# EAGLE design mainBoard (EAGLE 7.2.0)

## Sheet 1 of 5: CPU
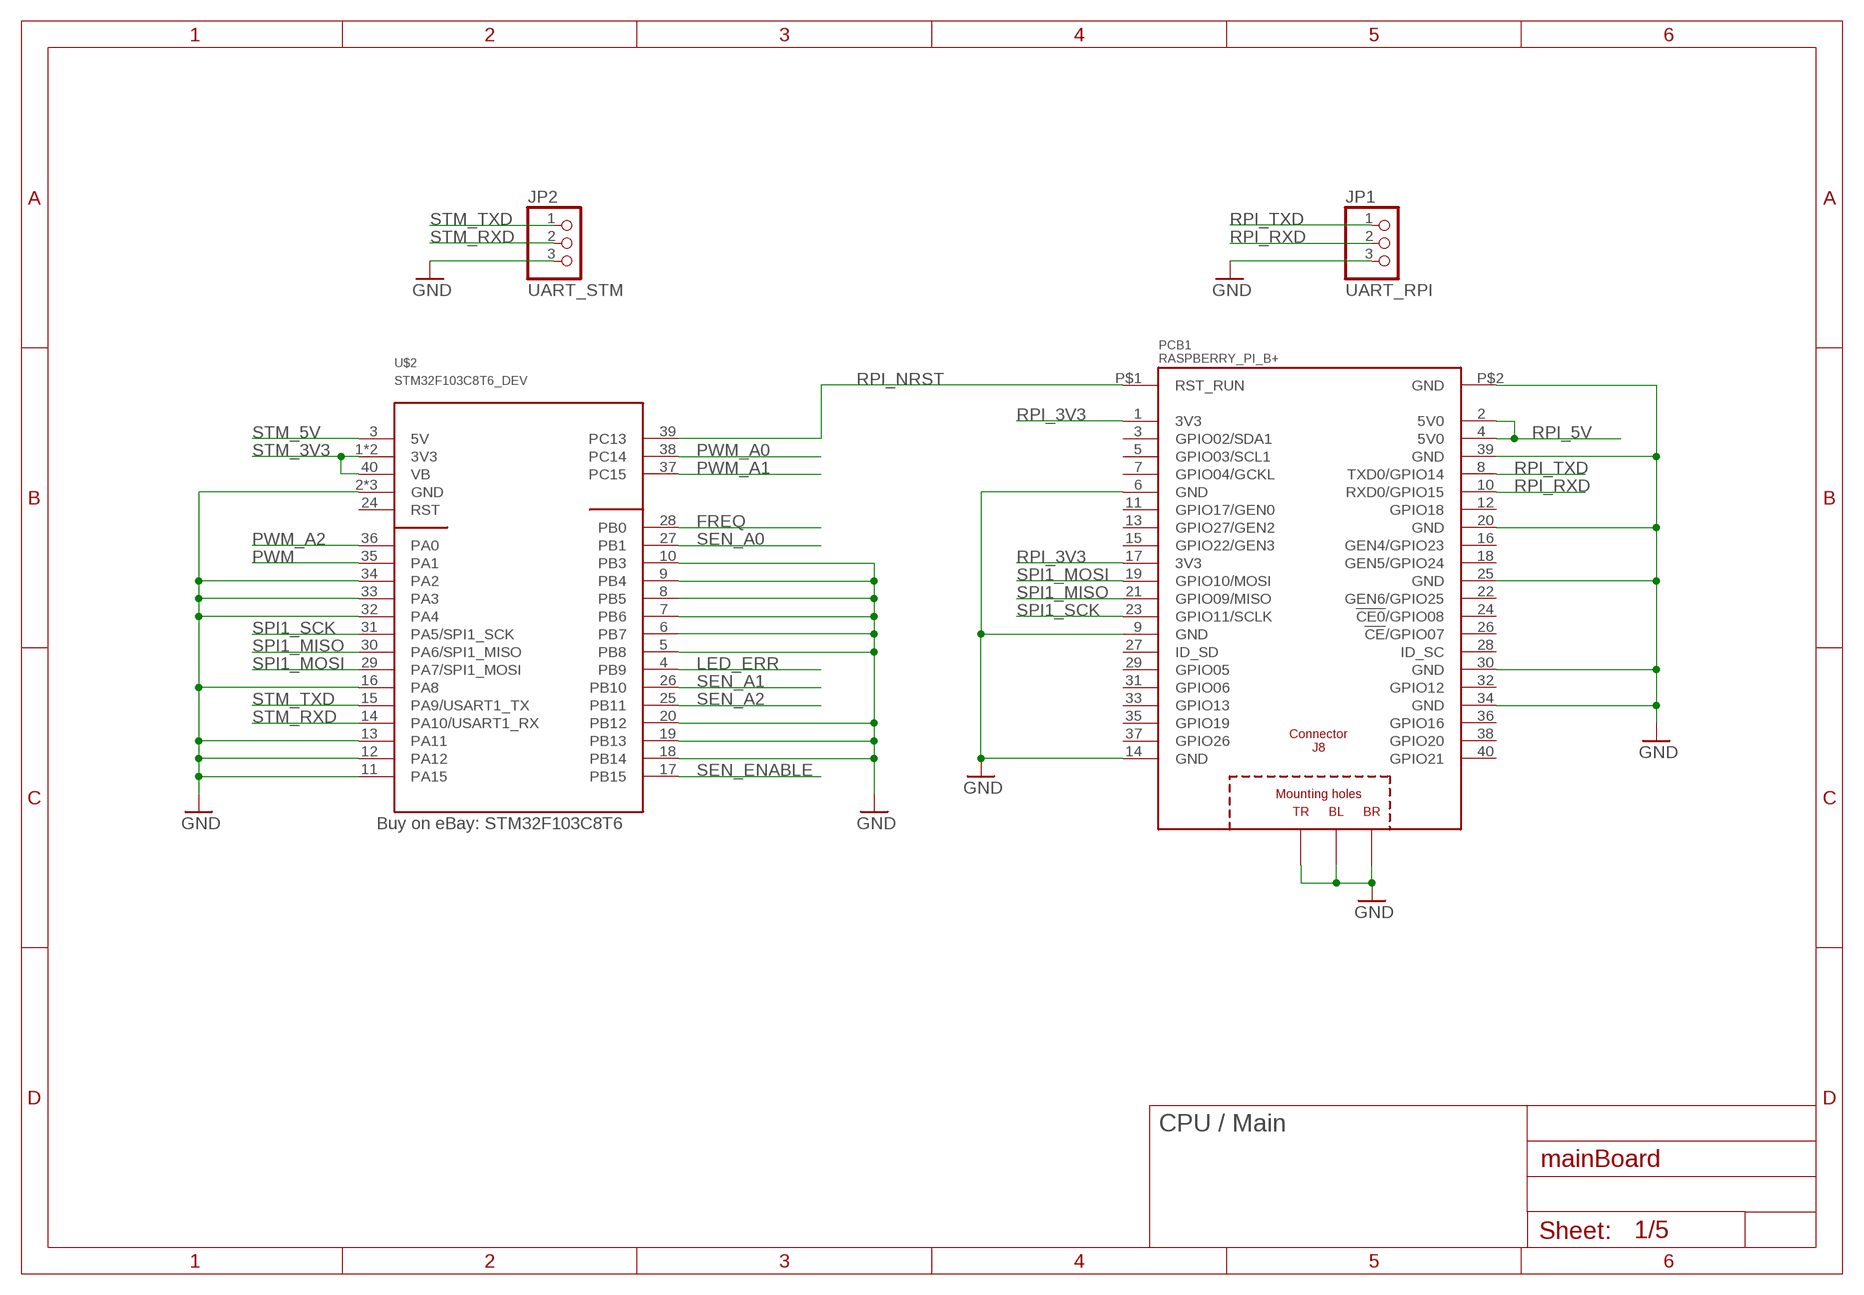
[diagram p0: schematic, sheet 1]

### Parts
JP1  UART_RPI  PINHD-1X3  [1X03]
JP2  UART_STM  PINHD-1X3  [1X03]
PCB1  RASPBERRY_PI_B+  [RASPBERRY_PI_BPLUS_TPLACE_SMD_MIRR]
U$2  STM32F103C8T6_DEV  [STM32F103C8T6_DEV_SMD]

### Nets
FREQ: U$2.28(PB0) ; also sheet 3
GND: JP1.3 JP2.3 PCB1.6(GND) PCB1.9(GND) PCB1.14(GND) PCB1.20(GND) PCB1.25(GND) PCB1.30(GND) PCB1.34(GND) PCB1.39(GND) PCB1.P$2(GND) PCB1.PE_BL(BL) PCB1.PE_BR(BR) PCB1.PE_TR(TR) U$2.2(GND) U$2.5(PB8) U$2.6(PB7) U$2.7(PB6) U$2.8(PB5) U$2.9(PB4) U$2.10(PB3) U$2.11(PA15) U$2.12(PA12) U$2.13(PA11) U$2.16(PA8) U$2.18(PB14) U$2.19(PB13) U$2.20(PB12) U$2.21(GND) U$2.22(GND) U$2.32(PA4) U$2.33(PA3) U$2.34(PA2) ; also sheet 2,3,4,5
LED_ERR: U$2.4(PB9) ; also sheet 5
PWM: U$2.35(PA1) ; also sheet 4
PWM_A0: U$2.38(PC14) ; also sheet 4
PWM_A1: U$2.37(PC15) ; also sheet 4
PWM_A2: U$2.36(PA0) ; also sheet 4
RPI_3V3: PCB1.1(3V3) PCB1.17(3V3) ; also sheet 2
RPI_5V: PCB1.2(5V0) PCB1.4(5V0) ; also sheet 2
RPI_NRST: PCB1.P$1(RST_RUN) U$2.39(PC13)
RPI_RXD: JP1.2 PCB1.10(RXD0/GPIO15)
RPI_TXD: JP1.1 PCB1.8(TXD0/GPIO14)
SEN_A0: U$2.27(PB1) ; also sheet 3
SEN_A1: U$2.26(PB10) ; also sheet 3
SEN_A2: U$2.25(PB11) ; also sheet 3
SEN_ENABLE: U$2.17(PB15) ; also sheet 3
SPI1_MISO: PCB1.21(GPIO09/MISO) U$2.30(PA6/SPI1_MISO)
SPI1_MOSI: PCB1.19(GPIO10/MOSI) U$2.29(PA7/SPI1_MOSI)
SPI1_SCK: PCB1.23(GPIO11/SCLK) U$2.31(PA5/SPI1_SCK)
STM_3V3: U$2.1(3V3) U$2.23(3V3) U$2.40(VB) ; also sheet 2
STM_5V: U$2.3(5V) ; also sheet 2
STM_RXD: JP2.2 U$2.14(PA10/USART1_RX)
STM_TXD: JP2.1 U$2.15(PA9/USART1_TX)
Unconnected: PCB1.3(GPIO02/SDA1) PCB1.5(GPIO03/SCL1) PCB1.7(GPIO04/GCKL) PCB1.11(GPIO17/GEN0) PCB1.12(GPIO18) PCB1.13(GPIO27/GEN2) PCB1.15(GPIO22/GEN3) PCB1.16(GEN4/GPIO23) PCB1.18(GEN5/GPIO24) PCB1.22(GEN6/GPIO25) PCB1.24(!CE0!/GPIO08) PCB1.26(!CE!/GPIO07) PCB1.27(ID_SD) PCB1.28(ID_SC) PCB1.29(GPIO05) PCB1.31(GPIO06) PCB1.32(GPIO12) PCB1.33(GPIO13) PCB1.35(GPIO19) PCB1.36(GPIO16) PCB1.37(GPIO26) PCB1.38(GPIO20) PCB1.40(GPIO21) U$2.24(RST)

### Notes on the sheet
- Buy on eBay: STM32F103C8T6
- CPU / Main

## Sheet 2 of 5: PowerSupply
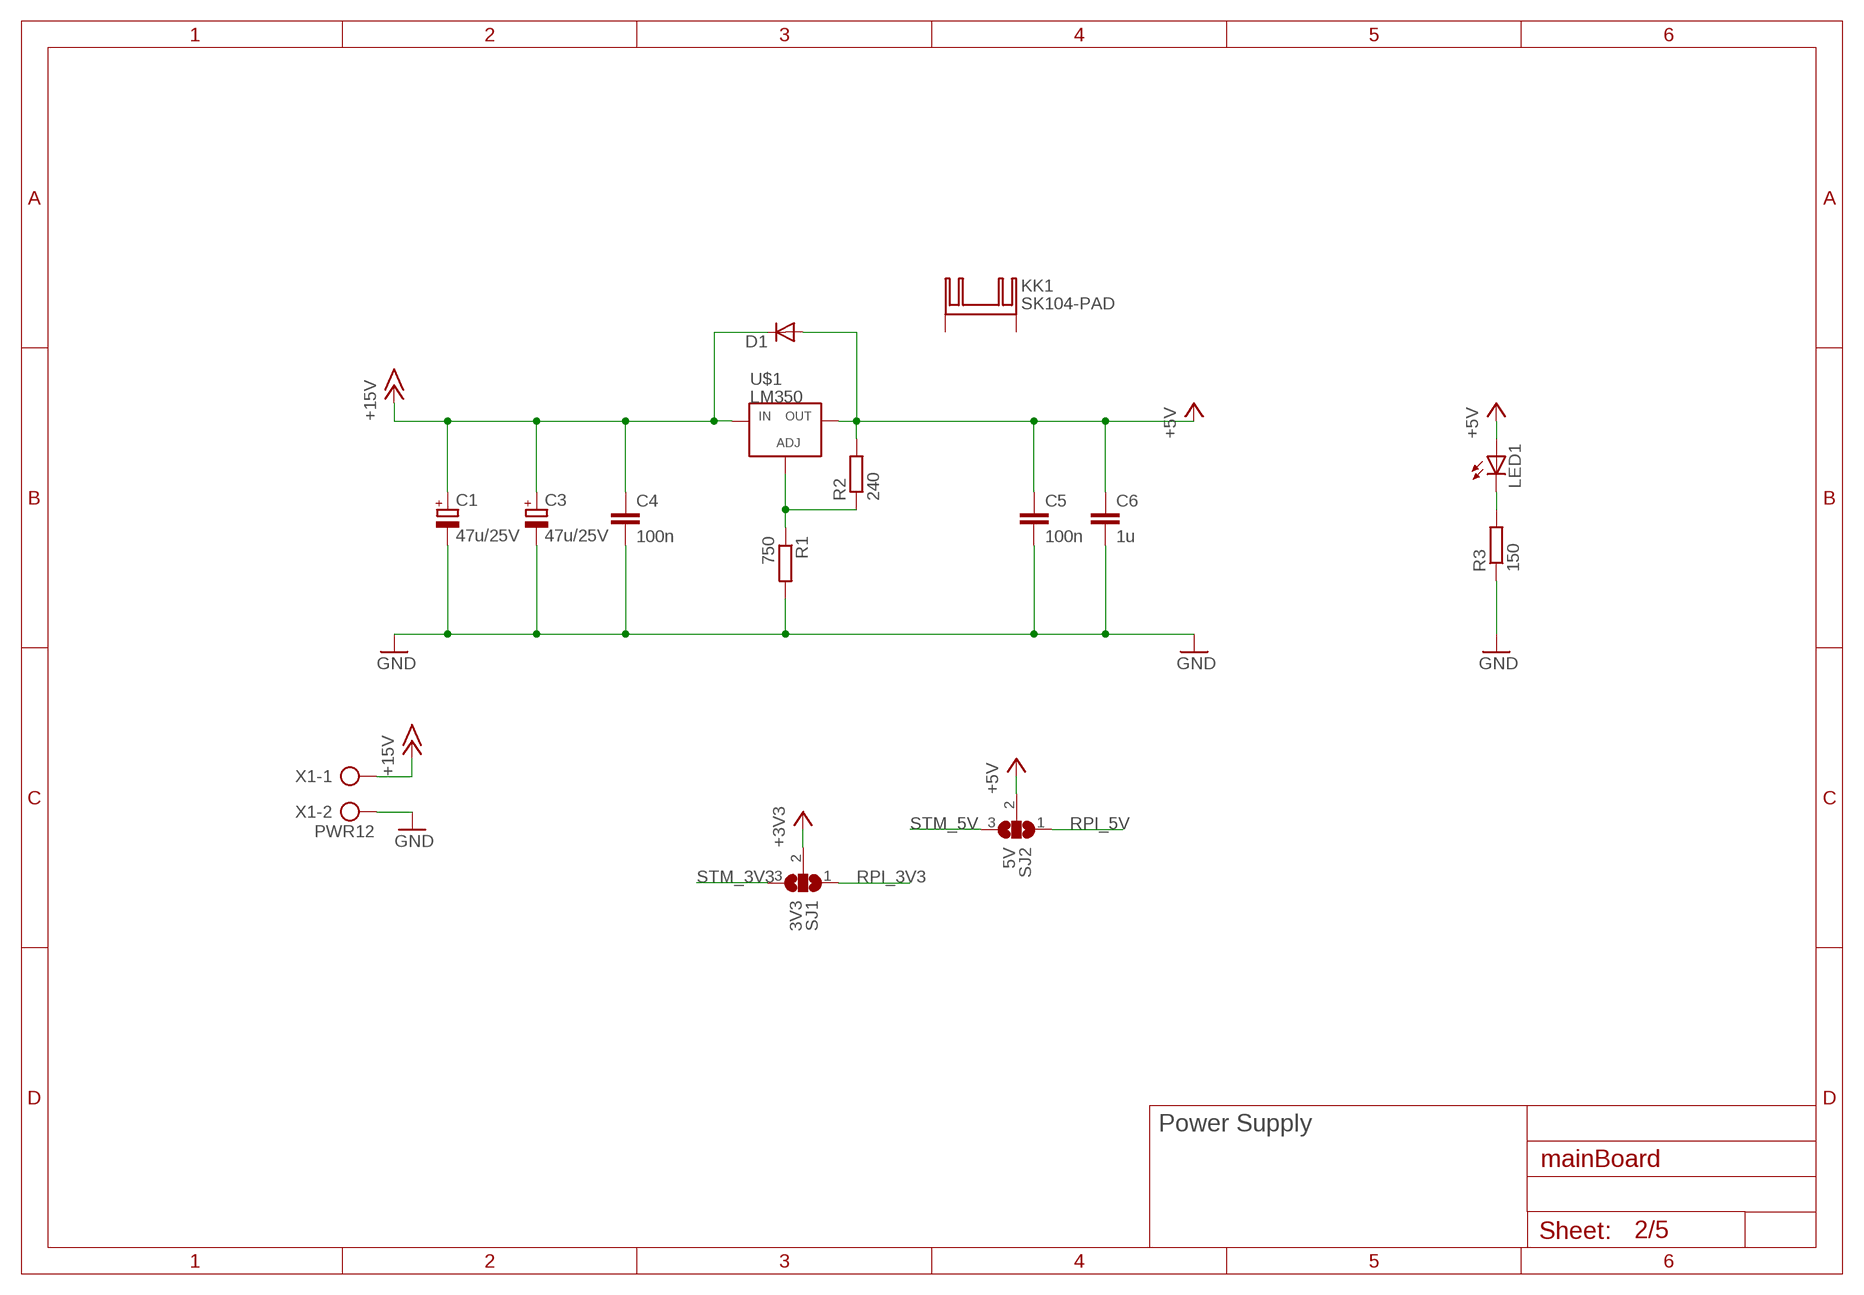
[diagram p1: schematic, sheet 2]

### Parts
C1  47u/25V  CPOL-EUD  [PANASONIC_D]
C3  47u/25V  CPOL-EUD  [PANASONIC_D]
C4  100n  C-EUC0805  [C0805]
C5  100n  C-EUC0805  [C0805]
C6  1u  C-EUC0805  [C0805]
D1  DIODE-MELF-MLL41  [MELF-MLL41]
KK1  SK104-PAD  [SK104-PAD]
LED1  LEDCHIP-LED0805  [CHIP-LED0805]
R1  750  R-EU_R0805  [R0805]
R2  240  R-EU_R0805  [R0805]
R3  150  R-EU_R0805  [R0805]
SJ1  3V3  SJ2W  [SJ_2]
SJ2  5V  SJ2W  [SJ_2]
U$1  LM350  [TO220]
X1  PWR12  AK500/2  [AK500/2]

### Nets
+3V3: SJ1.2 ; also sheet 3,4
+5V: C5.1 C6.1 D1.A LED1.A R2.2 SJ2.2 U$1.2(OUT)
+15V: C1.+ C3.+ C4.1 D1.C U$1.3(IN) X1.1 ; also sheet 4
GND: C1.- C3.- C4.2 C5.2 C6.2 R1.2 R3.1 X1.2 ; also sheet 1,3,4,5
N$9: LED1.C R3.2
N$20: R1.1 R2.1 U$1.1(ADJ)
RPI_3V3: SJ1.1 ; also sheet 1
RPI_5V: SJ2.1 ; also sheet 1
STM_3V3: SJ1.3 ; also sheet 1
STM_5V: SJ2.3 ; also sheet 1
Unconnected: KK1.K1(K) KK1.K2(K)

### Notes on the sheet
- Power Supply

## Sheet 3 of 5: Sensors
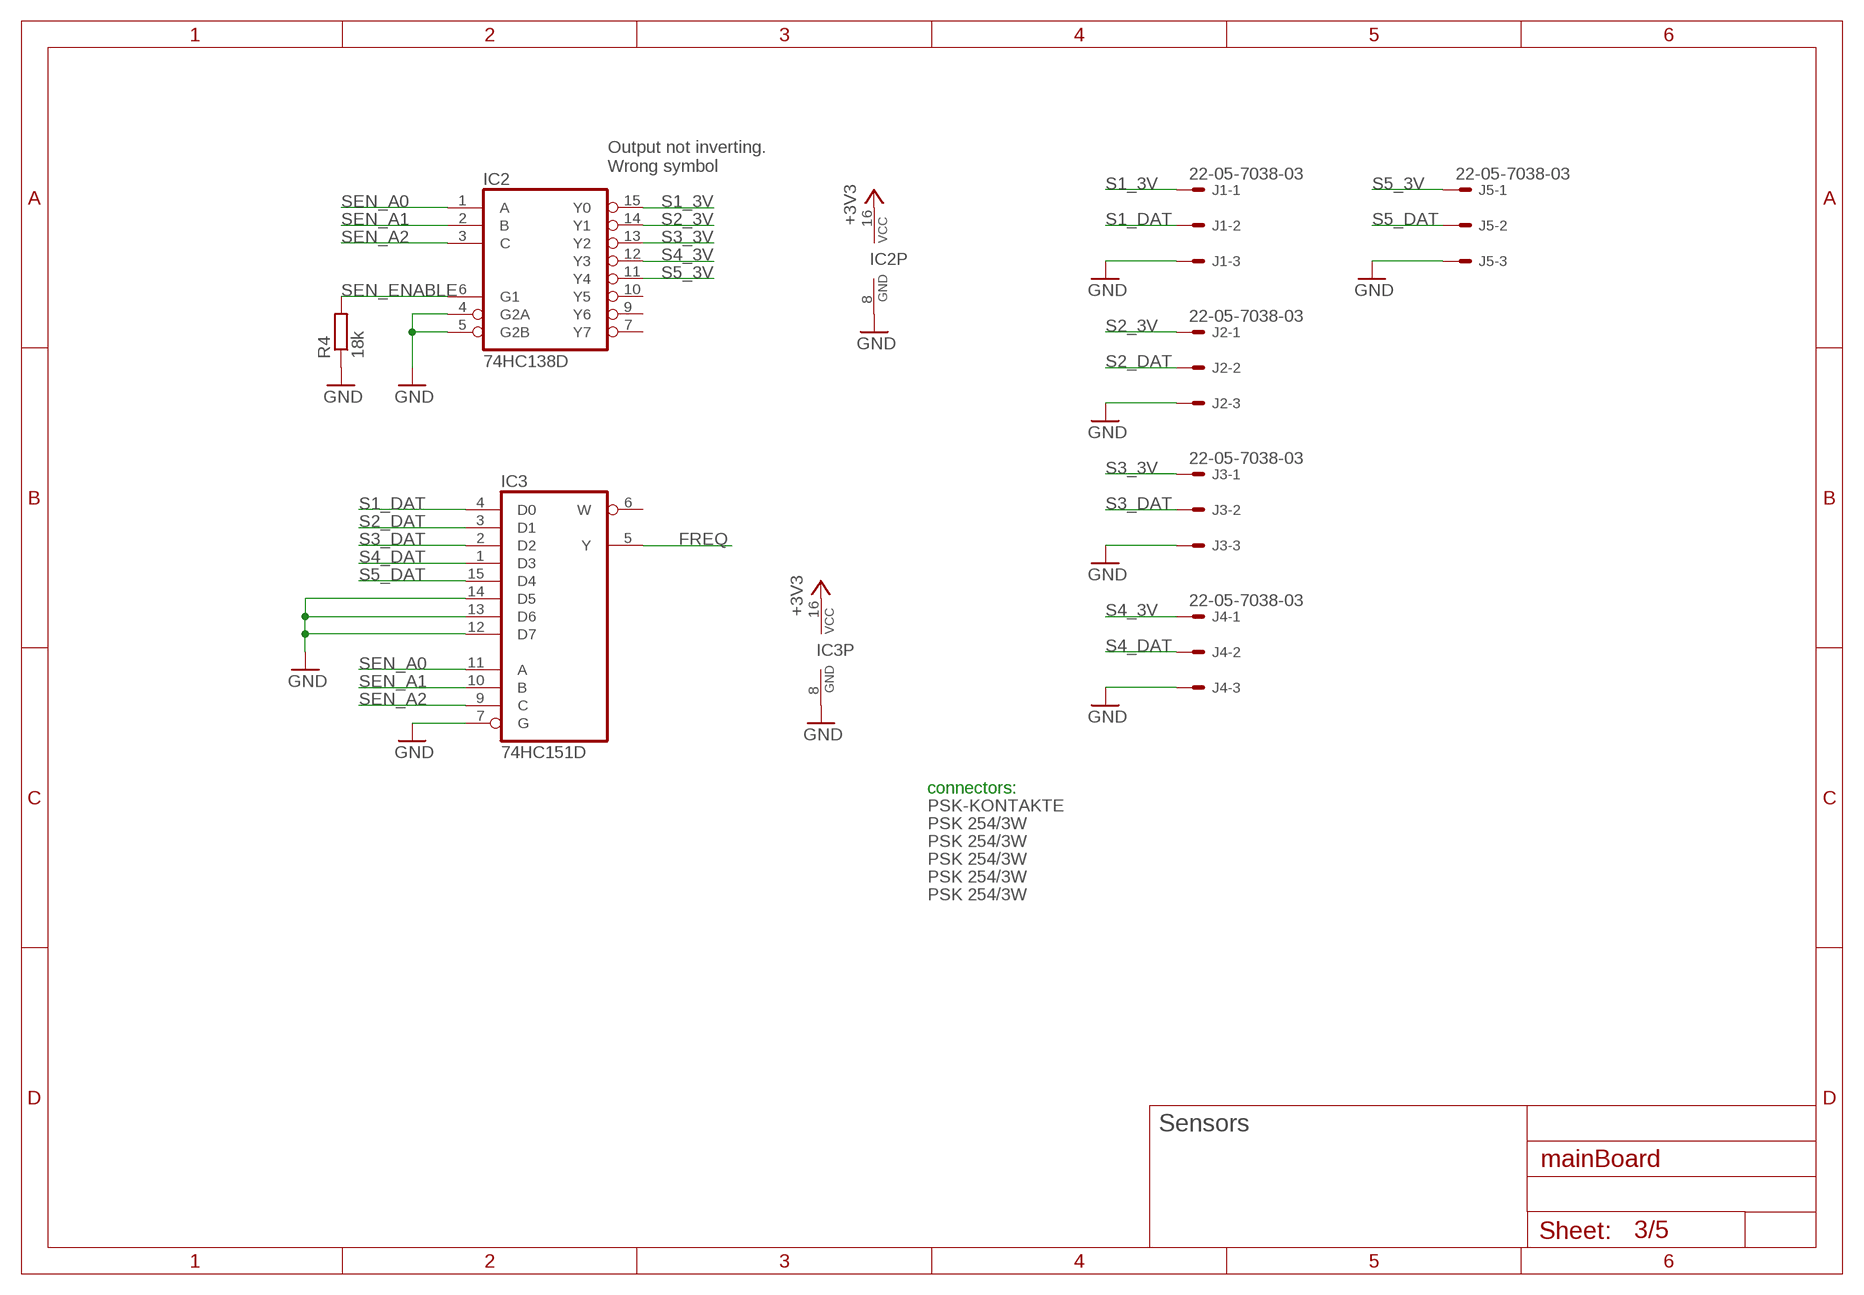
[diagram p2: schematic, sheet 3]

### Parts
IC2  74HC138D  [SO16]
IC3  74HC151D  [SO16]
J1  22-05-7038-03  [7395-03]
J2  22-05-7038-03  [7395-03]
J3  22-05-7038-03  [7395-03]
J4  22-05-7038-03  [7395-03]
J5  22-05-7038-03  [7395-03]
R4  18k  R-EU_R0805  [R0805]
U$3  PSK 254/3W  DUMMY_BOM  [DUMMY_BOM]
U$4  PSK 254/3W  DUMMY_BOM  [DUMMY_BOM]
U$5  PSK 254/3W  DUMMY_BOM  [DUMMY_BOM]
U$6  PSK 254/3W  DUMMY_BOM  [DUMMY_BOM]
U$7  PSK 254/3W  DUMMY_BOM  [DUMMY_BOM]
U$8  PSK-KONTAKTE  DUMMY_BOM  [DUMMY_BOM]

### Nets
+3V3: IC2.16(VCC) IC3.16(VCC) ; also sheet 2,4
FREQ: IC3.5(Y) ; also sheet 1
GND: IC2.4(G2A) IC2.5(G2B) IC2.8(GND) IC3.7(G) IC3.8(GND) IC3.12(D7) IC3.13(D6) IC3.14(D5) J1.3 J2.3 J3.3 J4.3 J5.3 R4.1 ; also sheet 1,2,4,5
S1_3V: IC2.15(Y0) J1.1
S1_DAT: IC3.4(D0) J1.2
S2_3V: IC2.14(Y1) J2.1
S2_DAT: IC3.3(D1) J2.2
S3_3V: IC2.13(Y2) J3.1
S3_DAT: IC3.2(D2) J3.2
S4_3V: IC2.12(Y3) J4.1
S4_DAT: IC3.1(D3) J4.2
S5_3V: IC2.11(Y4) J5.1
S5_DAT: IC3.15(D4) J5.2
SEN_A0: IC2.1(A) IC3.11(A) ; also sheet 1
SEN_A1: IC2.2(B) IC3.10(B) ; also sheet 1
SEN_A2: IC2.3(C) IC3.9(C) ; also sheet 1
SEN_ENABLE: IC2.6(G1) R4.2 ; also sheet 1
Unconnected: IC2.7(Y7) IC2.9(Y6) IC2.10(Y5) IC3.6(W)

### Notes on the sheet
- Output not inverting.
  Wrong symbol
- connectors:
- Sensors

## Sheet 4 of 5: Pumps
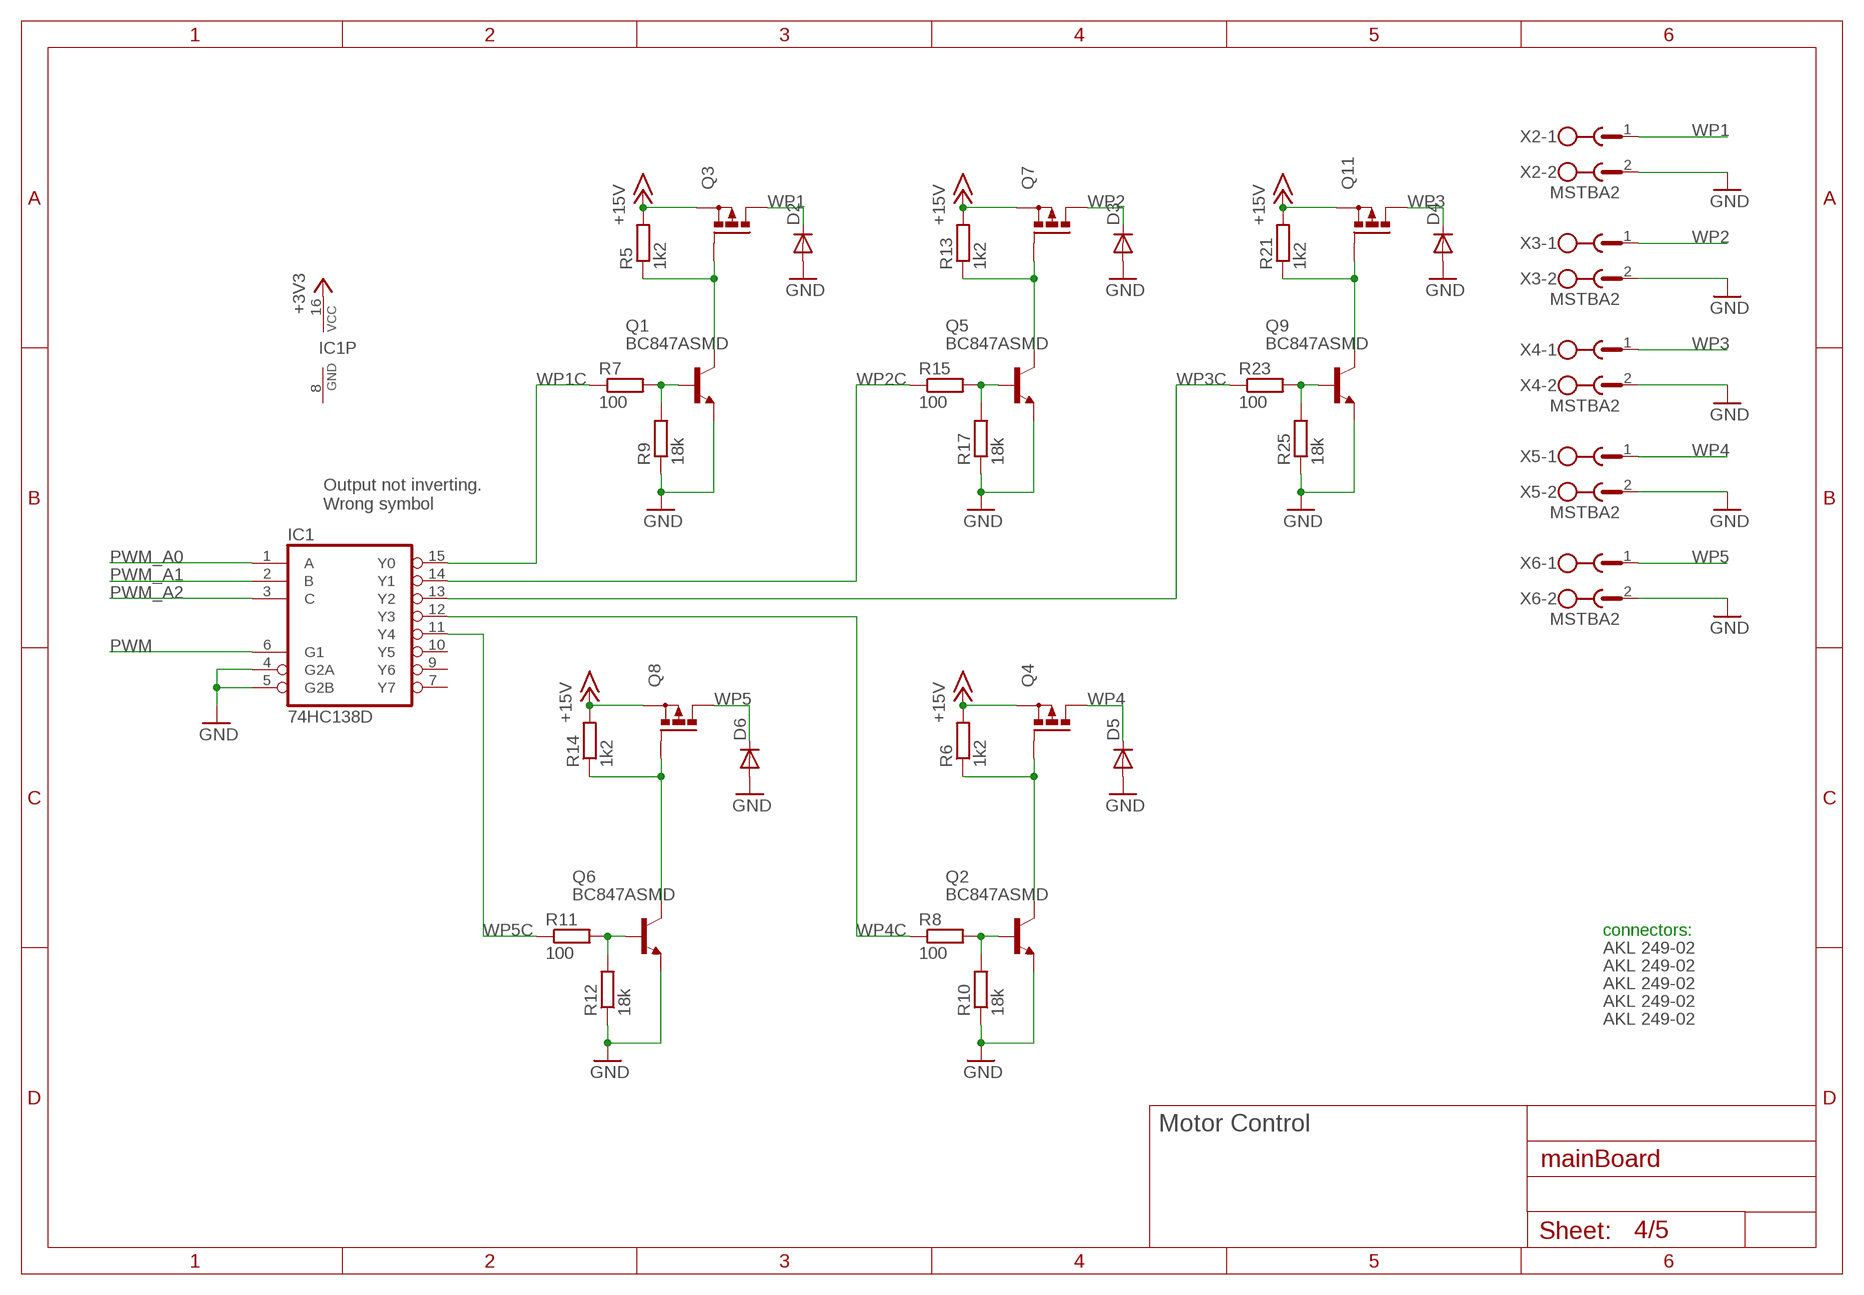
[diagram p3: schematic, sheet 4]

### Parts
D2  DIODE-DO-214AC  [DO-214AC]
D3  DIODE-DO-214AC  [DO-214AC]
D4  DIODE-DO-214AC  [DO-214AC]
D5  DIODE-DO-214AC  [DO-214AC]
D6  DIODE-DO-214AC  [DO-214AC]
IC1  74HC138D  [SO16]
Q1  BC847ASMD  [SOT23]
Q2  BC847ASMD  [SOT23]
Q3  P-MOSFET-SO8  [SO-08]
Q4  P-MOSFET-SO8  [SO-08]
Q5  BC847ASMD  [SOT23]
Q6  BC847ASMD  [SOT23]
Q7  P-MOSFET-SO8  [SO-08]
Q8  P-MOSFET-SO8  [SO-08]
Q9  BC847ASMD  [SOT23]
Q11  P-MOSFET-SO8  [SO-08]
R5  1k2  R-EU_R0805  [R0805]
R6  1k2  R-EU_R0805  [R0805]
R7  100  R-EU_R0805  [R0805]
R8  100  R-EU_R0805  [R0805]
R9  18k  R-EU_R0805  [R0805]
R10  18k  R-EU_R0805  [R0805]
R11  100  R-EU_R0805  [R0805]
R12  18k  R-EU_R0805  [R0805]
R13  1k2  R-EU_R0805  [R0805]
R14  1k2  R-EU_R0805  [R0805]
R15  100  R-EU_R0805  [R0805]
R17  18k  R-EU_R0805  [R0805]
R21  1k2  R-EU_R0805  [R0805]
R23  100  R-EU_R0805  [R0805]
R25  18k  R-EU_R0805  [R0805]
U$9  AKL 249-02  DUMMY_BOM  [DUMMY_BOM]
U$10  AKL 249-02  DUMMY_BOM  [DUMMY_BOM]
U$11  AKL 249-02  DUMMY_BOM  [DUMMY_BOM]
U$12  AKL 249-02  DUMMY_BOM  [DUMMY_BOM]
U$13  AKL 249-02  DUMMY_BOM  [DUMMY_BOM]
X2  MSTBA2  [MSTBA2]
X3  MSTBA2  [MSTBA2]
X4  MSTBA2  [MSTBA2]
X5  MSTBA2  [MSTBA2]
X6  MSTBA2  [MSTBA2]

### Nets
+3V3: IC1.16(VCC) ; also sheet 2,3
+15V: Q3.1(S) Q3.2(S) Q3.3(S) Q4.1(S) Q4.2(S) Q4.3(S) Q7.1(S) Q7.2(S) Q7.3(S) Q8.1(S) Q8.2(S) Q8.3(S) Q11.1(S) Q11.2(S) Q11.3(S) R5.2 R6.2 R13.2 R14.2 R21.2 ; also sheet 2
GND: D2.A D3.A D4.A D5.A D6.A IC1.4(G2A) IC1.5(G2B) Q1.2(E) Q2.2(E) Q5.2(E) Q6.2(E) Q9.2(E) R9.1 R10.1 R12.1 R17.1 R25.1 X2.2 X3.2 X4.2 X5.2 X6.2 ; also sheet 1,2,3,5
N$2: Q5.3(C) Q7.4(G) R13.1
N$3: Q1.3(C) Q3.4(G) R5.1
N$4: Q6.3(C) Q8.4(G) R14.1
N$5: Q1.1(B) R7.2 R9.2
N$6: Q6.1(B) R11.2 R12.2
N$7: Q5.1(B) R15.2 R17.2
N$8: Q9.3(C) Q11.4(G) R21.1
N$11: Q9.1(B) R23.2 R25.2
N$13: Q2.3(C) Q4.4(G) R6.1
N$15: Q2.1(B) R8.2 R10.2
PWM: IC1.6(G1) ; also sheet 1
PWM_A0: IC1.1(A) ; also sheet 1
PWM_A1: IC1.2(B) ; also sheet 1
PWM_A2: IC1.3(C) ; also sheet 1
WP1: D2.C Q3.5(D) Q3.6(D) Q3.7(D) Q3.8(D) X2.1
WP1C: IC1.15(Y0) R7.1
WP2: D3.C Q7.5(D) Q7.6(D) Q7.7(D) Q7.8(D) X3.1
WP2C: IC1.14(Y1) R15.1
WP3: D4.C Q11.5(D) Q11.6(D) Q11.7(D) Q11.8(D) X4.1
WP3C: IC1.13(Y2) R23.1
WP4: D5.C Q4.5(D) Q4.6(D) Q4.7(D) Q4.8(D) X5.1
WP4C: IC1.12(Y3) R8.1
WP5: D6.C Q8.5(D) Q8.6(D) Q8.7(D) Q8.8(D) X6.1
WP5C: IC1.11(Y4) R11.1
Unconnected: IC1.7(Y7) IC1.9(Y6) IC1.10(Y5)

### Notes on the sheet
- Output not inverting.
  Wrong symbol
- connectors:
- Motor Control

## Sheet 5 of 5: OtherThings
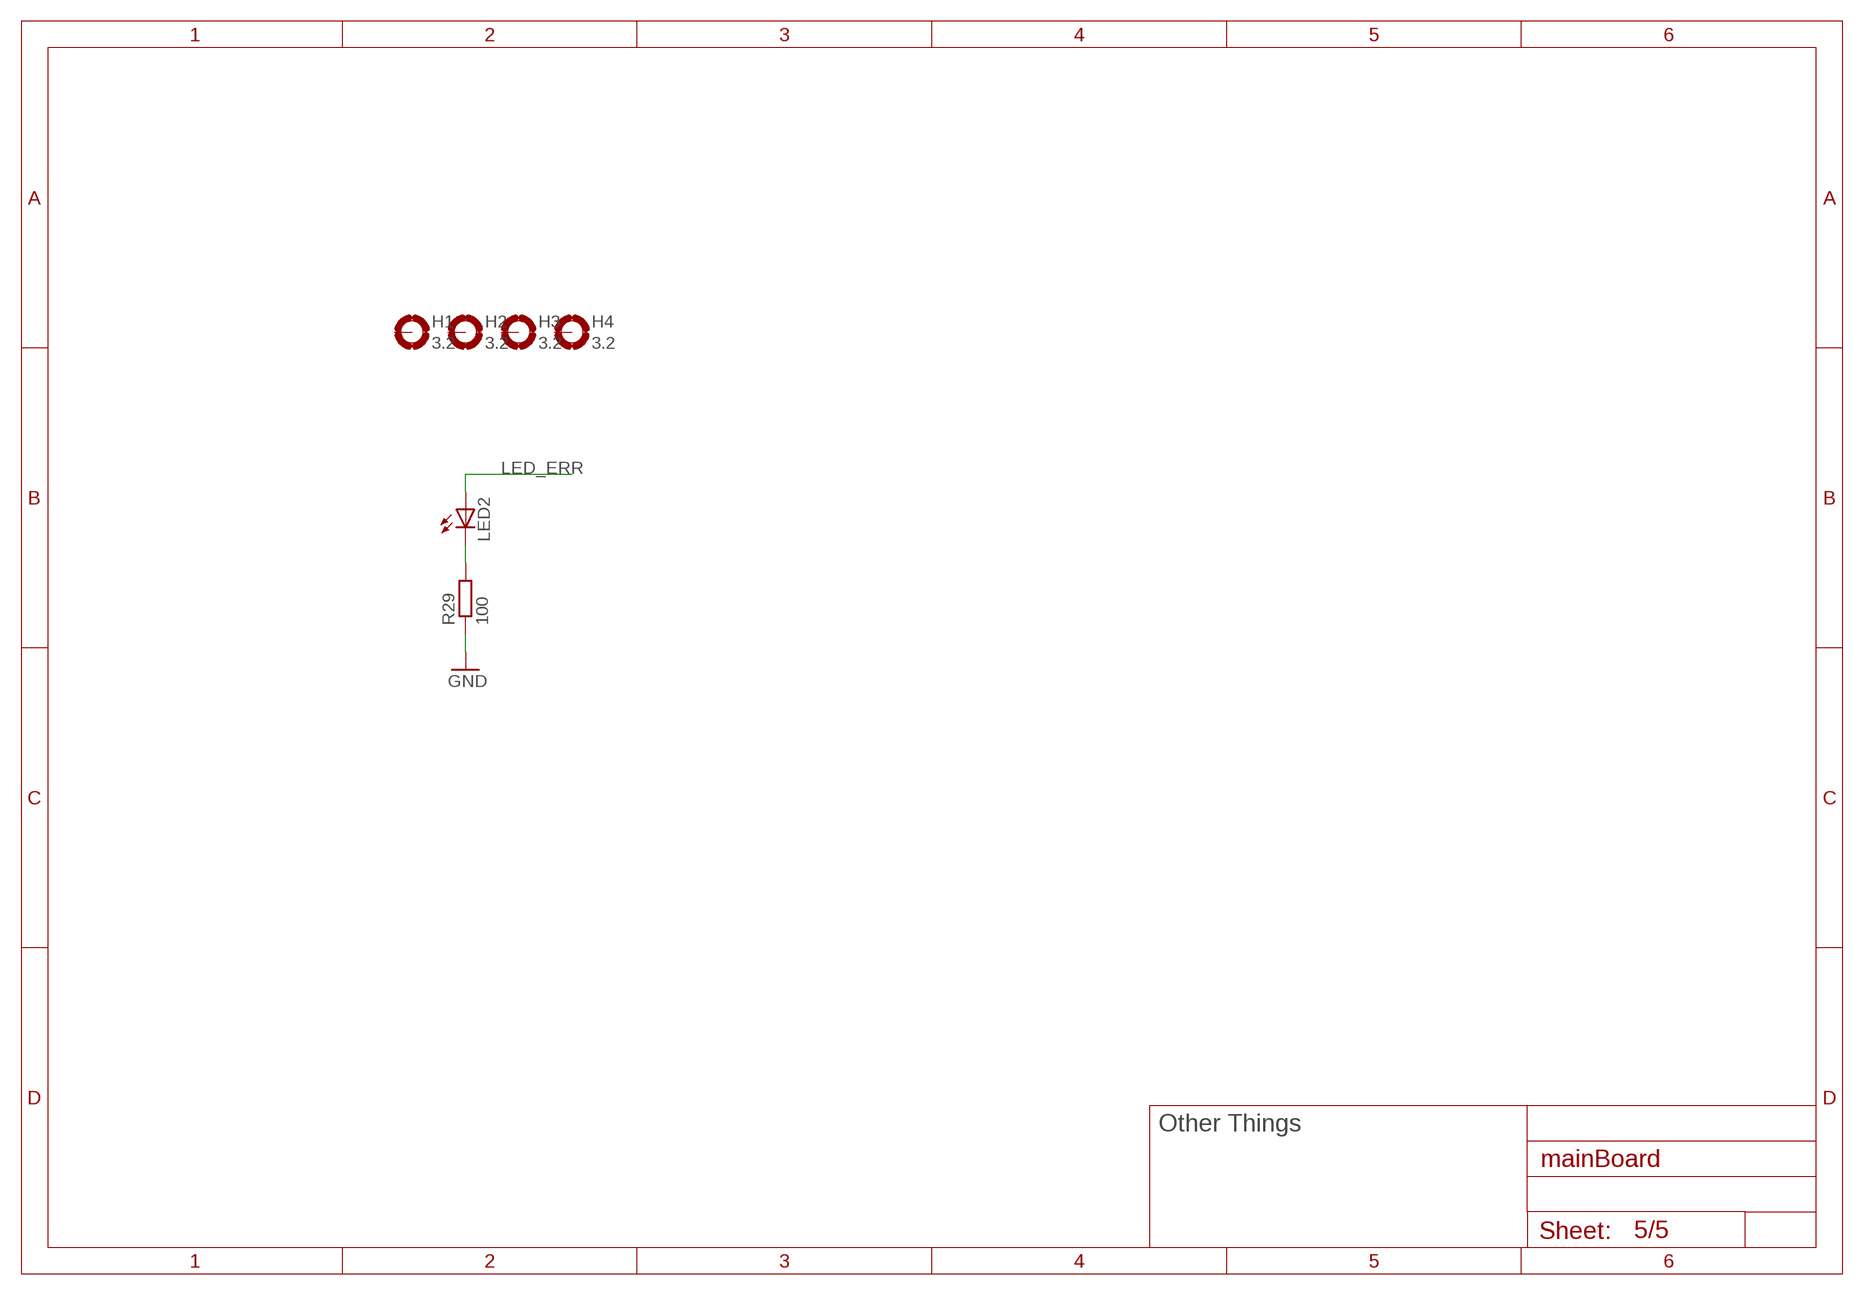
[diagram p4: schematic, sheet 5]

### Parts
H1  3.2  MOUNT-PAD-ROUND3.2  [3,2-PAD]
H2  3.2  MOUNT-PAD-ROUND3.2  [3,2-PAD]
H3  3.2  MOUNT-PAD-ROUND3.2  [3,2-PAD]
H4  3.2  MOUNT-PAD-ROUND3.2  [3,2-PAD]
LED2  LED3MM  [LED3MM]
R29  100  R-EU_R0805  [R0805]

### Nets
GND: R29.1 ; also sheet 1,2,3,4
LED_ERR: LED2.A ; also sheet 1
N$29: LED2.K(C) R29.2
Unconnected: H1.B3,2(MOUNT) H2.B3,2(MOUNT) H3.B3,2(MOUNT) H4.B3,2(MOUNT)

### Notes on the sheet
- Other Things

## Power pins joined to a net without a drawn wire
GND: IC1.8(GND)

## Library data of the parts
C1 C3 = rcl:CPOL-EU: POLARIZED CAPACITOR, European symbol; R: VF 47/25 P-D
C4 C5 = rcl:C-EU: CAPACITOR, European symbol; R: X7R-G0805 100N
C6 = rcl:C-EU: CAPACITOR, European symbol; R: X7R-G0805 1,0/25
D1 = diode:DIODE-: DIODE; R: 1N 4002 SMD
D2-D6 = diode:DIODE-: DIODE; R: B 140 F
H1-H4 = holes:MOUNT-PAD-ROUND: MOUNTING PAD, round
IC1 IC2 = 74xx-eu:74*138: 3-line to 8-line DECODER/DEMULTIPLEXER; R: SMD HC 238
IC3 = 74xx-eu:74*151: Data SELECTOR/MULTIPLEXER; R: SMD HC 151
J1-J5 = con-molex:22-?-03: CONNECTOR wire to board 2.54 mm (.1 inch) pitch header; OC_FARNELL: unknown; OC_NEWARK: unknown; R: PSS 254/3W
JP1 JP2 = pinhead:PINHD-1X3: PIN HEADER; R: MPE 087-1-003
KK1 = heatsink:SK104-PAD: HEATSINK manufacturer Fischer/distributor Buerklin; R: V PR32/25,4
LED1 = led:LED: LED OSRAM: - CHIPLED LG R971, LG N971, LY N971, LG Q971, LY Q971, LO R971, LY R971 LH N974, LH R974 LS Q976, LO Q976, LY Q976 LO Q996 - Hyper CHIPLED LW Q18S LB Q993, LB Q99A, LB R99A - SideLED LS A670, LO A670, LY A670, LG A670, LP A670 LB A673, LV A673, LT A673, LW A673 LH A674 LY A675 LS A676, LA A676, LO A676, LY A676, LW A676 LS A679, LY A679, LG A679 - Hyper Micro SIDELED® LS Y876, LA Y876, LO Y876, LY Y876 LT Y87S - SmartLED LW L88C, LW L88S LB L89C, LB L89S, LG L890 LS L89K, LO L89K, LY L89K LS L896, LA L896, LO L896, LY L896 - TOPLED LS T670, LO T670, LY T670, LG T670, LP T670 LSG T670, LSP T670, LSY T670, LOP T670, LYG T670 LG T671, LOG T671, LSG T671 LB T673, LV T673, LT T673, LW T673 LH T674 LS T676, LA T676, LO T676, LY T676, LB T676, LH T676, LSB T676, LW T676 LB T67C, LV T67C, LT T67C, LS T67K, LO T67K, LY T67K, LW E67C LS E67B, LA E67B, LO E67B, LY E67B, LB E67C, LV E67C, LT E67C LW T67C LS T679, LY T679, LG T679 LS T770, LO T770, LY T770, LG T770, LP T770 LB T773, LV T773, LT T773, LW T773 LH T774 LS E675, LA E675, LY E675, LS T675 LS T776, LA T776, LO T776, LY T776, LB T776 LHGB T686 LT T68C, LB T68C - Hyper Mini TOPLED® LB M676 - Mini TOPLED Santana® LG M470 LS M47K, LO M47K, LY M47K Source: http://www.osram.convergy.de LUXEON: - LUMILED® LXK2-PW12-R00, LXK2-PW12-S00, LXK2-PW14-U00, LXK2-PW14-V00 LXK2-PM12-R00, LXK2-PM12-S00, LXK2-PM14-U00 LXK2-PE12-Q00, LXK2-PE12-R00, LXK2-PE12-S00, LXK2-PE14-T00, LXK2-PE14-U00 LXK2-PB12-K00, LXK2-PB12-L00, LXK2-PB12-M00, LXK2-PB14-N00, LXK2-PB14-P00, LXK2-PB14-Q00 LXK2-PR12-L00, LXK2-PR12-M00, LXK2-PR14-Q00, LXK2-PR14-R00 LXK2-PD12-Q00, LXK2-PD12-R00, LXK2-PD12-S00 LXK2-PH12-R00, LXK2-PH12-S00 LXK2-PL12-P00, LXK2-PL12-Q00, LXK2-PL12-R00 Source: www.luxeon.com KINGBRIGHT: KA-3528ASYC Source: www.kingbright.com; R: SMD-LED 0805 GN
LED2 = led:LED: LED OSRAM: - CHIPLED LG R971, LG N971, LY N971, LG Q971, LY Q971, LO R971, LY R971 LH N974, LH R974 LS Q976, LO Q976, LY Q976 LO Q996 - Hyper CHIPLED LW Q18S LB Q993, LB Q99A, LB R99A - SideLED LS A670, LO A670, LY A670, LG A670, LP A670 LB A673, LV A673, LT A673, LW A673 LH A674 LY A675 LS A676, LA A676, LO A676, LY A676, LW A676 LS A679, LY A679, LG A679 - Hyper Micro SIDELED® LS Y876, LA Y876, LO Y876, LY Y876 LT Y87S - SmartLED LW L88C, LW L88S LB L89C, LB L89S, LG L890 LS L89K, LO L89K, LY L89K LS L896, LA L896, LO L896, LY L896 - TOPLED LS T670, LO T670, LY T670, LG T670, LP T670 LSG T670, LSP T670, LSY T670, LOP T670, LYG T670 LG T671, LOG T671, LSG T671 LB T673, LV T673, LT T673, LW T673 LH T674 LS T676, LA T676, LO T676, LY T676, LB T676, LH T676, LSB T676, LW T676 LB T67C, LV T67C, LT T67C, LS T67K, LO T67K, LY T67K, LW E67C LS E67B, LA E67B, LO E67B, LY E67B, LB E67C, LV E67C, LT E67C LW T67C LS T679, LY T679, LG T679 LS T770, LO T770, LY T770, LG T770, LP T770 LB T773, LV T773, LT T773, LW T773 LH T774 LS E675, LA E675, LY E675, LS T675 LS T776, LA T776, LO T776, LY T776, LB T776 LHGB T686 LT T68C, LB T68C - Hyper Mini TOPLED® LB M676 - Mini TOPLED Santana® LG M470 LS M47K, LO M47K, LY M47K Source: http://www.osram.convergy.de LUXEON: - LUMILED® LXK2-PW12-R00, LXK2-PW12-S00, LXK2-PW14-U00, LXK2-PW14-V00 LXK2-PM12-R00, LXK2-PM12-S00, LXK2-PM14-U00 LXK2-PE12-Q00, LXK2-PE12-R00, LXK2-PE12-S00, LXK2-PE14-T00, LXK2-PE14-U00 LXK2-PB12-K00, LXK2-PB12-L00, LXK2-PB12-M00, LXK2-PB14-N00, LXK2-PB14-P00, LXK2-PB14-Q00 LXK2-PR12-L00, LXK2-PR12-M00, LXK2-PR14-Q00, LXK2-PR14-R00 LXK2-PD12-Q00, LXK2-PD12-R00, LXK2-PD12-S00 LXK2-PH12-R00, LXK2-PH12-S00 LXK2-PL12-P00, LXK2-PL12-Q00, LXK2-PL12-R00 Source: www.luxeon.com KINGBRIGHT: KA-3528ASYC Source: www.kingbright.com; R: SLK 3MM RT
PCB1 = RASPBERRY_PI_Bplus:RASPBERRY_PI_B+: Raspberry Pi B+ Basedon issue: Thursday, July 10, 2014 - Rev 1.2 LBR by Tim Rettmann 07-2014
Q1 Q2 Q5 Q6 Q9 = transistor-npn:BC847*: NPN Transistor; R: BC 847A SMD
Q3 Q4 Q7 Q8 Q11 = transistor-power:P-MOSFET-SO8: P-Channel MOSFET Example: FDS4435A; P-Channel Logic Level PowerTrench® MOSFET FDS4465; P-Channel 1.8V Specified PowerTrench® MOSFET Source: www.fairchildsemi.com; R: IRF 9332
R1 = rcl:R-EU_: RESISTOR, European symbol; R: SPR-0805 750
R2 = rcl:R-EU_: RESISTOR, European symbol; R: SPR-0805 240
R3 = rcl:R-EU_: RESISTOR, European symbol; R: SMD-0805 150
R4 R9 R10 R12 R17 R25 = rcl:R-EU_: RESISTOR, European symbol; R: SMD-0805 18,0K
R5 R6 R13 R14 R21 = rcl:R-EU_: RESISTOR, European symbol; R: SMD-0805 1,20K
R7 R8 R11 R15 R23 R29 = rcl:R-EU_: RESISTOR, European symbol; R: SMD-0805 100
SJ1 SJ2 = jumper:SJ2W: SMD solder JUMPER
U$1 = extra:LM350; R: LM 350-220
U$2 = extra:STM32F103C8T6_DEV
U$3-U$7 = extra:DUMMY_BOM; R: PSK 254/3W
U$8 = extra:DUMMY_BOM; R: PSK-KONTAKTE
U$9-U$13 = extra:DUMMY_BOM; R: AKL 249-02
X1 = con-ptr500:AK500/2: CONNECTOR; OC_FARNELL: unknown; OC_NEWARK: unknown; R: AKL 101-02
X2-X6 = con-phoenix-508:MSTBA2: PHOENIX; MF: FARNELL; MPN: 1757242; OC_FARNELL: 3705171; OC_NEWARK: 71C4161; R: AKL 230-02

## Net classes
0 default: clearance 0.355 mm

## Board
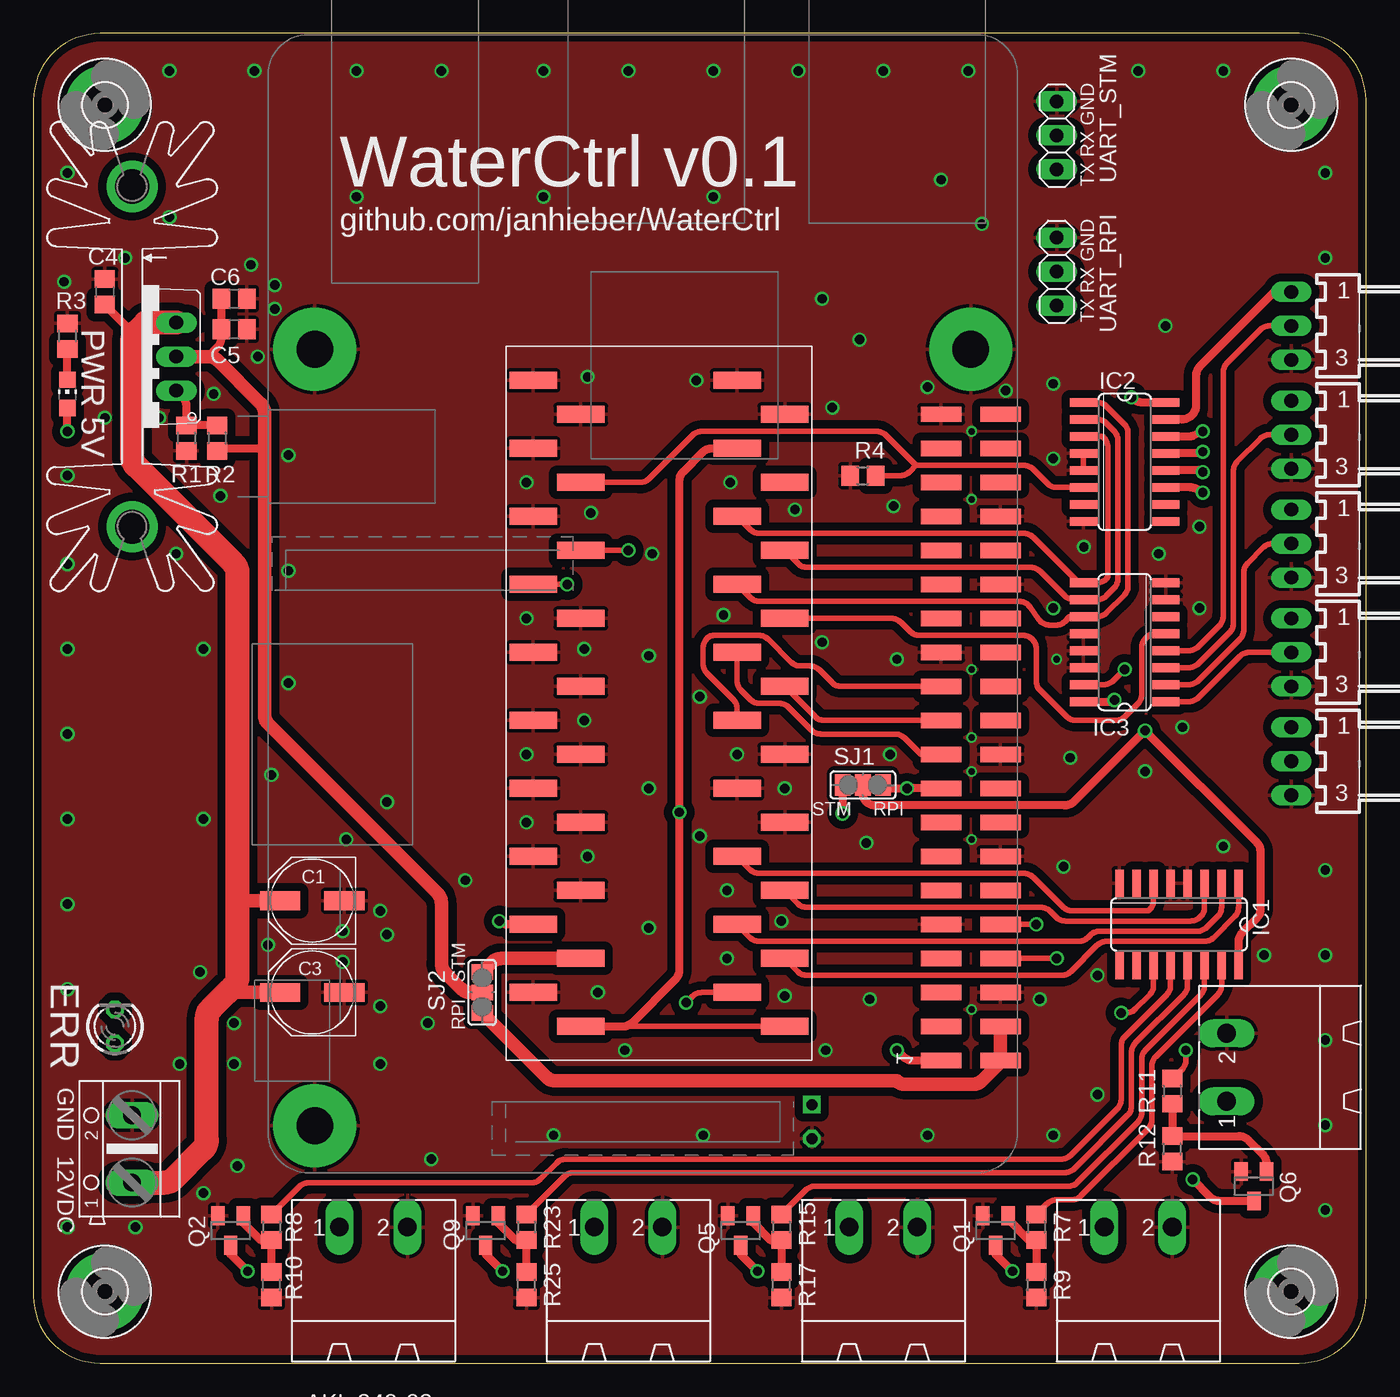
[diagram p5: board, top side]
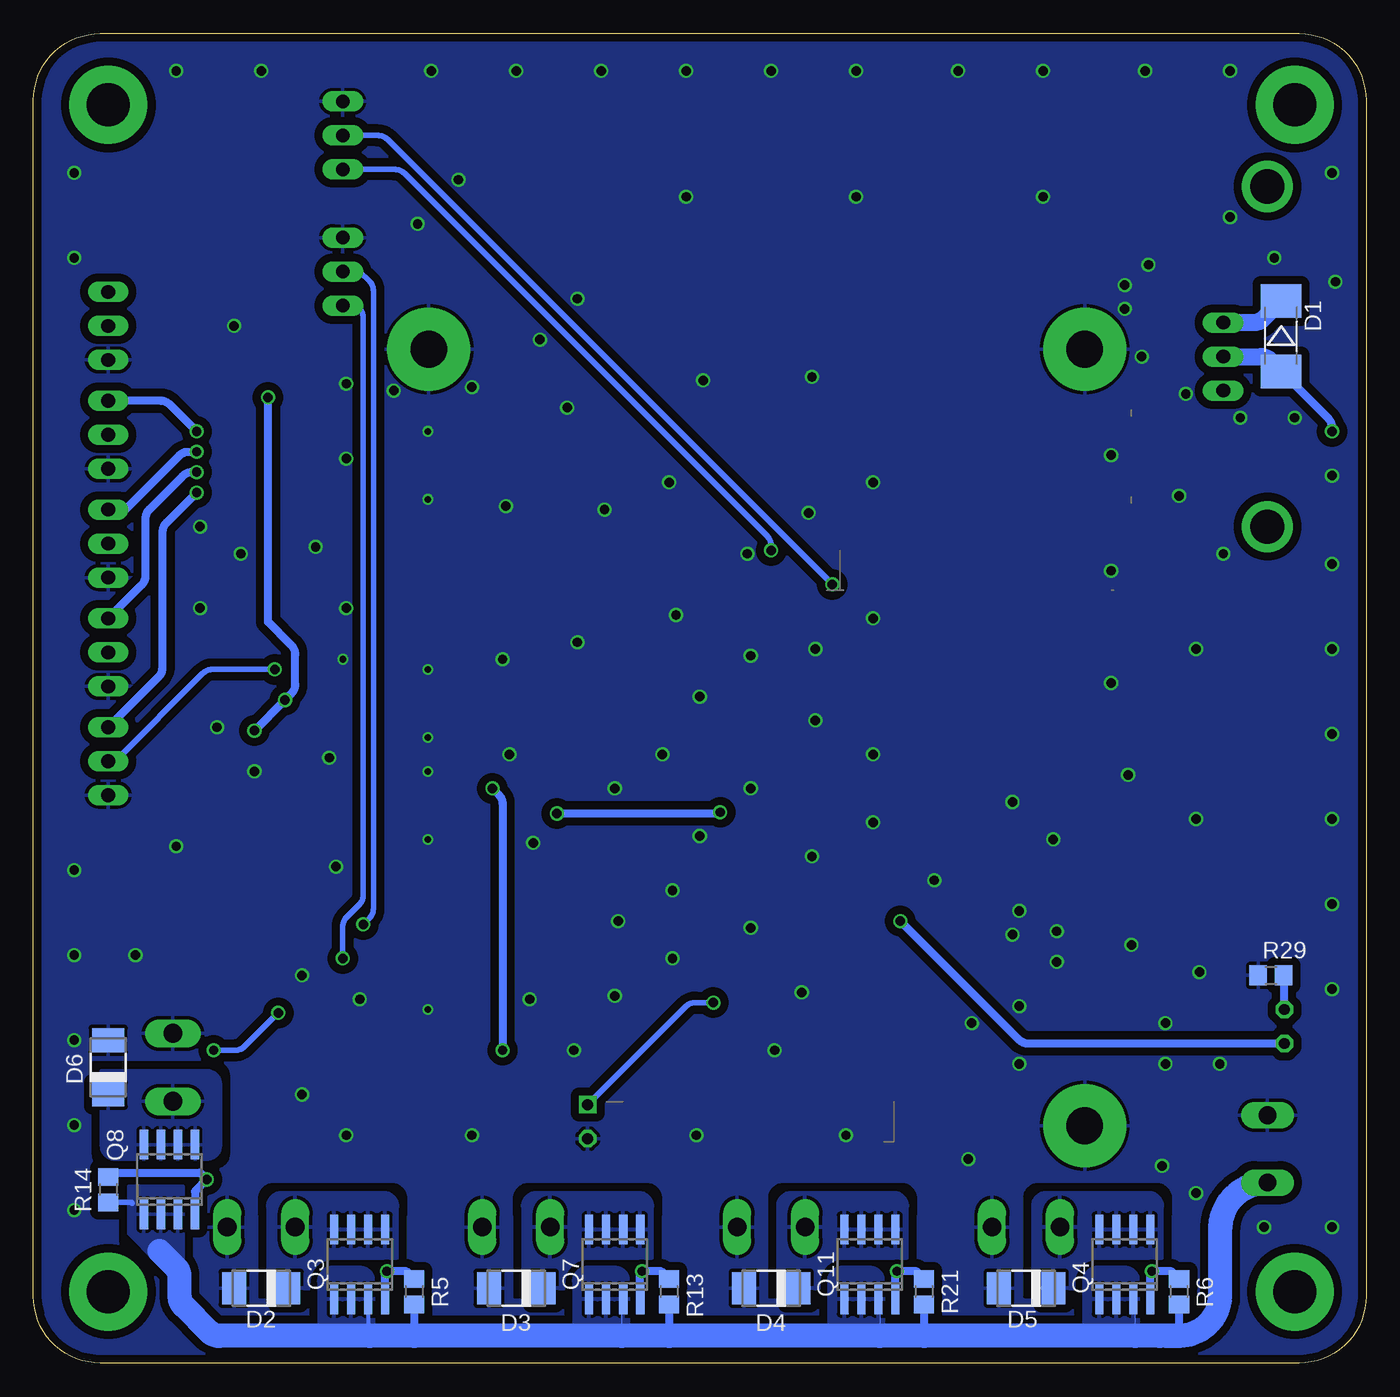
[diagram p6: board, bottom side, seen from below]

Size 99.57 x 99.31 mm. Coordinates in mm from the lower left corner, seen from the top.
Outline: 0,94.31 0,5 arc90 5,0 94.57,0 arc90 99.57,5 99.57,94.31 arc90 94.57,99.31 5,99.31 arc90 0,94.31
Copper layers (1*16): Top 0.035mm / dielectric 1.5mm / Bottom 0.035mm
Design rules "dirt_cheap_dirty_boards.v1": minimum track width 5mil, minimum drill 12mil, track to track 5mil, track to pad 5mil, pad to pad 5mil, via to via 5mil, smd to smd 0mil, copper to edge 10mil, drill to drill 10mil, minimum pad ring 10mil, minimum via ring 6mil, stop-mask expansion 2mil, vias tented up to drill 25mil, thermal gap 10mil

### Footprints (pad centres in the part's own frame; a part is rotated, then mirrored left to right if it is on the bottom)
PANASONIC_D = smd 3 x 1.4: + 2.4,0; - -2.4,0
C0805 = smd 1.3 x 1.5: 1 -0.95,0; 2 0.95,0
MELF-MLL41 = smd 2.5 x 3: A 2.625,0; C -2.625,0
DO-214AC = smd 1.8 x 2.4: A 2.025,0; C -2.025,0
3,2-PAD = drill 3.2 pad 5.842: B3,2 0,0
SO16 = smd 0.66 x 2.032: 1 -4.445,-3.073; 2 -3.175,-3.073; 3 -1.905,-3.073; 4 -0.635,-3.073; 5 0.635,-3.073; 6 1.905,-3.073; 7 3.175,-3.073; 8 4.445,-3.073; 9 4.445,3.073; 10 3.175,3.073; 11 1.905,3.073; 12 0.635,3.073; 13 -0.635,3.073; 14 -1.905,3.073; 15 -3.175,3.073; 16 -4.445,3.073
7395-03 = drill 1.016 long: 1 2.54,0; 2 0,0; 3 -2.54,0
1X03 = drill 1.016 long: 1 -2.54,0; 2 0,0; 3 2.54,0
SK104-PAD = drill 2.54 pad 3.81: K1 -12.7,-0.762; K2 12.7,-0.762
CHIP-LED0805 = smd 1.2 x 1.2: A 0,-1.05; C 0,1.05
LED3MM = drill 0.813 octagon: A -1.27,0; K 1.27,0
RASPBERRY_PI_BPLUS_TPLACE_SMD_MIRR = smd 1.143 x 3.048: 1 76.708,50.292; 2 76.708,54.737; 3 74.168,50.292; 4 74.168,54.737; 5 71.628,50.292; 6 71.628,54.737; 7 69.088,50.292; 8 69.088,54.737; 9 66.548,50.292; 10 66.548,54.737; 11 64.008,50.292; 12 64.008,54.737; 13 61.468,50.292; 14 61.468,54.737; 15 58.928,50.292; 16 58.928,54.737; 17 56.388,50.292; 18 56.388,54.737; 19 53.848,50.292; 20 53.848,54.737; 21 51.308,50.292; 22 51.308,54.737; 23 48.768,50.292; 24 48.768,54.737; 25 46.228,50.292; 26 46.228,54.737; 27 43.688,50.292; 28 43.688,54.737; 29 41.148,50.292; 30 41.148,54.737; 31 38.608,50.292; 32 38.608,54.737; 33 36.068,50.292; 34 36.068,54.737; 35 33.528,50.292; 36 33.528,54.737; 37 30.988,50.292; 38 30.988,54.737; 39 28.448,50.292; 40 28.448,54.737 | drill 0.8 square: P$1 80.01,40.64 | drill 0.8 octagon: P$2 82.55,40.64 | drill 2.75 pad 6.2: PE_BL 81.59,3.5; PE_BR 23.59,3.5; PE_TR 23.59,52.5
SOT23 = smd 1 x 1.4: 1 -0.95,-1.1; 2 0.95,-1.1; 3 0,1.1
SO-08 = smd 0.6 x 2.2: 1 -1.905,-2.6; 2 -0.635,-2.6; 3 0.635,-2.6; 4 1.905,-2.6; 5 1.905,2.6; 6 0.635,2.6; 7 -0.635,2.6; 8 -1.905,2.6
R0805 = smd 1.3 x 1.5: 1 -0.95,0; 2 0.95,0
SJ_2 = smd 1.168 x 1.6: 1 -1.524,0; 2 0,0; 3 1.524,0
TO220 = drill 1.016 long: 1 -2.54,-2.54; 2 0,-2.54; 3 2.54,-2.54
STM32F103C8T6_DEV_SMD = smd 1.27 x 3.556: 1 50.8,5.588; 2 48.26,2.032; 3 45.72,5.588; 4 43.18,2.032; 5 40.64,5.588; 6 38.1,2.032; 7 35.56,5.588; 8 33.02,2.032; 9 30.48,5.588; 10 27.94,2.032; 11 25.4,5.588; 12 22.86,2.032; 13 20.32,5.588; 14 17.78,2.032; 15 15.24,5.588; 16 12.7,2.032; 17 10.16,5.588; 18 7.62,2.032; 19 5.08,5.588; 20 2.54,2.032; 21 2.54,17.272; 22 5.08,20.828; 23 7.62,17.272; 24 10.16,20.828; 25 12.7,17.272; 26 15.24,20.828; 27 17.78,17.272; 28 20.32,20.828; 29 22.86,17.272; 30 25.4,20.828; 31 27.94,17.272; 32 30.48,20.828; 33 33.02,17.272; 34 35.56,20.828; 35 38.1,17.272; 36 40.64,20.828; 37 43.18,17.272; 38 45.72,20.828; 39 48.26,17.272; 40 50.8,20.828
AK500/2 = drill 1.321 long: 1 -2.515,0; 2 2.515,0
MSTBA2 = drill 1.397 long: 1 -2.54,5.08; 2 2.54,5.08

### Placement (x,y rotation side)
C1  20.83,34.54 180 top
C3  20.83,27.69 180 top
C4  5.33,80.01 90 top
C5  14.99,77.22 0 top
C6  14.99,79.5 0 top
D1  6.35,76.71 270 bottom
D2  82.55,5.59 180 bottom
D3  63.5,5.59 180 bottom
D4  44.45,5.59 180 bottom
D5  25.4,5.59 180 bottom
D6  93.98,22.1 90 bottom
H1  5.33,5.33 0 top
H2  93.98,93.98 0 top
H3  5.33,93.98 0 top
H4  93.98,5.33 0 top
IC1  85.6,32.77 180 top
IC2  81.53,67.31 270 top
IC3  81.53,53.85 90 top
J1  93.98,77.47 90 top
J2  93.98,69.34 90 top
J3  93.98,61.21 90 top
J4  93.98,53.09 90 top
J5  93.98,44.96 90 top
JP1  76.45,81.53 90 top
JP2  76.45,91.69 90 top
KK1  8.13,75.18 270 top
LED1  2.54,72.39 0 top
LED2  6.1,25.15 90 top
PCB1  17.53,99.31 270 top
Q1  71.88,9.91 180 top
Q2  14.73,9.91 180 top
Q3  75.18,7.37 0 bottom
Q4  18.03,7.37 0 bottom
Q5  52.83,9.91 180 top
Q6  91.19,13.21 180 top
Q7  56.13,7.37 0 bottom
Q8  89.41,13.72 0 bottom
Q9  33.78,9.91 180 top
Q11  37.08,7.37 0 bottom
R1  11.43,69.09 270 top
R2  13.72,69.09 270 top
R3  2.54,76.71 270 top
R4  61.98,66.29 0 top
R5  71.12,5.33 270 bottom
R6  13.97,5.33 270 bottom
R7  74.93,10.16 270 top
R8  17.78,10.16 270 top
R9  74.93,5.84 90 top
R10  17.78,5.84 90 top
R11  85.09,20.32 270 top
R12  85.09,16 90 top
R13  52.07,5.33 270 bottom
R14  93.98,12.95 270 bottom
R15  55.88,10.16 270 top
R17  55.88,5.84 90 top
R21  33.02,5.33 270 bottom
R23  36.83,10.16 270 top
R25  36.83,5.84 90 top
R29  7.11,28.96 0 bottom
SJ1  61.98,43.18 180 top
SJ2  33.53,27.69 90 top
U$1  8.13,75.18 90 top
U$2  35.31,75.95 270 top
U$3  105.92,37.34 0 top  (outside the outline)
U$4  105.41,34.54 0 top  (outside the outline)
U$5  104.9,31.75 0 top  (outside the outline)
U$6  104.39,28.96 0 top  (outside the outline)
U$7  103.89,26.16 0 top  (outside the outline)
U$8  103.38,23.37 0 top  (outside the outline)
U$9  7.87,-3.81 0 top  (outside the outline)
U$10  7.62,-6.1 0 top  (outside the outline)
U$11  20.32,-3.56 0 top  (outside the outline)
U$12  20.32,-6.1 0 top  (outside the outline)
U$13  31.5,-4.32 0 top  (outside the outline)
X1  7.37,16 90 top
X2  82.55,5.08 0 top
X3  63.5,5.08 0 top
X4  44.45,5.08 0 top
X5  25.4,5.08 0 top
X6  94.23,22.1 90 top

### Tracks (layer width: path | path; a pad name or v marks a point on that pad's centre or on a via)
+3V3  (via drill 0.7)
  Top 0.61: IC3.16 80.64,49.4 v80.77,49.53 | v82.04,72.14 82.13,72.05 arc45 82.84,71.75 IC2.16 | IC1.16 90.04,31.46 arc-45 90.34,32.17 91.4,33.23 arc45 91.69,33.94 91.69,38.19 arc45 91.4,38.9 v83.06,47.24 77.76,41.95 arc-45 77.06,41.66 62.9,41.66 arc-45 62.19,41.95 arc-45 61.98,42.47 SJ1.2
  Bottom 0.61: v82.04,72.14 82.04,55.37 80.3,53.63 arc45 80.01,52.93 80.01,50.71 arc45 80.3,50 v80.77,49.53 v83.06,47.24
+5V  (via drill 0.7)
  Top 0.61: v2.54,69.6 LED1.A | C6.1 C5.1 14.04,76.59 arc-45 13.74,75.88 13.05,75.18 | R2.2 arc-45 14.17,68.33 17.27,68.33
  Top 1.016: U$1.2 13.05,75.18 arc-45 13.76,74.89 16.98,71.67 arc-45 17.27,70.96 17.27,68.33 17.27,48.42 arc45 17.57,47.71 30.19,35.09 arc-45 30.48,34.38 30.48,29.88 arc45 30.77,29.17 31.96,27.98 arc45 32.67,27.69 SJ2.2
  Bottom 0.61: D1.A 2.83,70.57 arc45 2.54,69.86 v2.54,69.6
  Bottom 1.27: U$1.2 7.87,75.18 arc45 7.16,74.89 D1.A
+15V
  Top 0.61: C4.1 7.21,77.19
  Top 1.016: 7.21,77.19 arc45 7.66,77 | C1.+ 15.24,34.54 | C3.+ 14.48,27.69
  Top 1.778: U$1.3 8.38,77.72 7.66,77 arc45 7.37,76.29 7.37,67.72 arc45 7.66,67.02 14.95,59.73 arc-45 15.24,59.02 15.24,34.54 15.24,28.86 arc-45 14.95,28.16 14.48,27.69 13.25,26.45 arc45 12.95,25.75 12.95,16.67 arc-45 12.66,15.96 10.48,13.78 arc-45 9.77,13.49 X1.1
  Bottom 0: Q7.3 55.63,4.64 55.63,2.03 | Q11.3 36.32,4.64 36.32,2.03 | Q4.3 17.27,4.77 17.27,2.03
  Bottom 0.305: Q3.3 74.55,2.41 arc90 74.42,2.03
  Bottom 0.406: R14.2 92.27,12 92.2,11.94
  Bottom 0.61: R5.2 71.12,2.03 | R13.2 52.07,2.03 | R21.2 33.02,2.03 | R6.2 13.97,2.03
  Bottom 1.27: D1.C 7.67,78.02 arc45 8.37,77.72 U$1.3
  Bottom 1.778: 14.92,2.03 13.97,2.03 | 14.92,2.03 17.27,2.03 33.02,2.03 36.32,2.03 52.07,2.03 55.63,2.03 71.12,2.03 74.42,2.03 85.69,2.03 arc45 86.4,2.33 88.35,4.28 arc45 88.65,4.99 88.65,6.44 arc-45 88.94,7.15 90.17,8.38 | X1.1 arc-90 10.92,9.93 10.92,5.08 arc90 13.97,2.03 | 13.97,2.03 15.43,2.03 arc45 14.92,2.03
  pour Bottom: 74.17,2.79 74.17,6.11 arc-90 75.17,7.11 77.23,7.11 arc-90 78.23,6.11 78.23,2.79
  pour Bottom: 55.12,2.79 55.12,6.11 arc-90 56.12,7.11 58.18,7.11 arc-90 59.18,6.11 59.18,2.79
  pour Bottom: 36.07,2.79 36.07,6.11 arc-90 37.07,7.11 39.13,7.11 arc-90 40.13,6.11 40.13,2.79
  pour Bottom: 20.08,7.11 arc-90 21.08,6.11 21.08,2.79
  pour Bottom: 17.02,2.79 17.02,6.11 arc-90 18.02,7.11 20.08,7.11 arc-90 21.08,6.11 21.08,2.79
  pour Bottom: 88.39,13.21 92.46,13.21 92.46,9.65 90.42,7.62 88.39,7.62
FREQ
  Top 0.406: U$2.28 64.1,55.63 arc-45 64.81,55.33 65.49,54.65 arc45 66.2,54.36 73.93,54.36 arc-90 74.93,53.36 74.93,50.96 arc45 75.22,50.25 77.18,48.3 arc45 77.88,48.01 80.87,48.01 arc45 81.57,48.3 82.51,49.24 arc45 82.8,49.94 82.8,53.43 arc-45 83.1,54.14 83.15,54.19 arc-45 83.85,54.48 IC3.5
GND  (via drill 0.5, 0.7)
  Top 0.406: IC2.4 IC2.5
  other vias: 2.54,66.29 5.33,70.61 6.86,82.55 9.4,70.61 13.46,72.39 13.97,64.77 16.76,75.18 18.03,78.74 18.03,80.52 16.26,82.04 2.29,80.77 10.67,60.45 19.05,67.82 19.05,59.18 19.05,50.8 12.7,53.34 17.78,43.94 12.7,40.64 23.37,39.12 26.42,41.91 42.16,27.69 17.53,31.24 23.11,29.97 23.11,32.26 25.91,33.78 25.91,26.67 14.99,25.4 59.18,23.37 55.88,33.02 75.18,27.18 64.52,52.58 67.82,88.39 70.87,85.09 58.93,79.5 61.72,76.45 49.53,73.41 56.9,63.75 64.01,45.47 56.13,42.93 52.07,65.79 51.56,55.88 41.66,63.5 15.24,14.73 12.45,29.21 25.91,22.35 14.99,22.35 29.46,25.4 10.92,22.35 62.48,27.18 51.82,30.23 84.58,77.47 78.49,60.96 72.64,72.64 66.8,72.9 87.12,62.48 87.12,56.39 84.07,60.45 85.85,47.5 83.06,44.2 76.96,37.08 88.9,38.61 91.95,30.48 79.5,28.96 79.5,20.07 76.2,17.02 96.52,36.83 96.52,30.48 96.52,24.13 96.52,17.78 96.52,11.43 96.52,82.55 96.52,88.9 88.9,96.52 82.55,96.52 69.85,96.52 63.5,96.52 57.15,96.52 50.8,96.52 44.45,96.52 38.1,96.52 30.48,96.52 24.13,96.52 16.51,96.52 10.16,96.52 2.54,88.9 2.54,59.69 2.54,53.34 2.54,46.99 2.54,40.64 2.54,34.29 2.54,27.94 2.54,10.16 7.62,10.16 12.7,12.7 66.8,17.02 50.04,17.02 38.86,17.02 29.72,15.24 32.26,36.07 26.42,32 45.97,32.51 41.4,37.85 45.97,42.93 41.15,48.01 45.97,52.83 46.23,60.45 64.26,64.01 58.93,53.85 52.58,45.47 62.23,38.86 77.47,45.21 36.83,65.79 36.83,55.63 36.83,45.47 41.15,53.34 36.83,40.39 49.78,49.78 49.78,39.37 51.82,35.31 44.2,23.37 56.13,27.43 50.8,87.12 38.1,87.12 24.13,87.12 10.16,85.6 59.69,71.37 41.4,73.66 76.2,56.39 76.2,67.56 76.2,73.15 70.1,64.52 70.1,69.6 70.1,51.82 70.1,44.2 70.1,46.74 70.1,39.12 70.1,26.42 76.45,52.58
  pour Top (isolate 0.61, rank 4): 99.39,94.06 99.32,5.17 arc-90 94.31,0.18 5.17,0.25 arc-90 0.17,5.25 0.17,94.06 arc-90 5.17,99.06 94.39,99.06 arc-90
  pour Bottom (isolate 0.61, rank 4): 5.28,0.37 94.18,0.33 arc90 99.18,5.32 99.29,94.07 arc90 94.29,99.07 5.32,99.05 arc90 0.32,94.05 0.28,5.37 arc90
LED_ERR  (via drill 0.7)
  Top 0.61: U$2.4 35.41,32.77 arc-45 v34.8,33.02
  Bottom 0.61: v34.8,33.02 25.95,24.17 arc-45 25.24,23.88 LED2.A
N$2  (via drill 0.7)
  Top 0.61: v54.1,6.86 52.83,8.13 Q5.3
  Bottom 0.61: Q7.4 54.23,6.73 v54.1,6.86 52.64,6.86 R13.1
N$3  (via drill 0.7)
  Top 0.61: v73.15,6.86 71.88,8.13 Q1.3
  Bottom 0.61: Q3.4 73.28,6.73 v73.15,6.86 71.69,6.86 R5.1
N$4  (via drill 0.7)
  Top 0.61: Q6.3 88.64,12.11 arc-45 87.93,12.4 v86.61,13.72
  Bottom 0.406: R14.1 93.66,14.22
  Bottom 0.61: Q8.4 87.5,12.83 v86.61,13.72 87.12,14.22 93.66,14.22
N$5
  Top 0.61: R7.2 74.49,9.21 74.42,9.14 | 74.42,9.14 72.83,10.73 Q1.1 | 74.42,9.14 74.93,8.64 R9.2
N$6
  Top 0.61: Q6.1 92.14,14.89 arc45 91.84,15.6 90.78,16.66 arc45 90.08,16.95 R12.2 R11.2
N$7
  Top 0.61: R15.2 55.81,9.14 | 55.81,9.14 55.12,9.14 53.78,10.48 Q5.1 | 55.81,9.14 55.88,9.08 R17.2
N$8  (via drill 0.7)
  Top 0.61: v35.05,6.86 33.78,8.13 Q9.3
  Bottom 0.61: Q11.4 35.18,6.73 v35.05,6.86 33.59,6.86 R21.1
N$9
  Top 0.61: LED1.C R3.2
N$11
  Top 0.61: Q9.1 34.73,10.48 36.07,9.14 36.76,9.14 R23.2 R25.2
N$13  (via drill 0.7)
  Top 0.61: v16,6.86 14.73,8.13 Q2.3
  Bottom 0.61: Q4.4 16.13,6.73 v16,6.86 14.54,6.86 R6.1
N$15
  Top 0.61: R10.2 R8.2 17.71,9.14 17.02,9.14 15.68,10.48 Q2.1
N$20
  Top 0.61: U$1.1 11.14,72.17 arc-45 11.43,71.47 R1.1 R2.1
N$29
  Bottom 0.61: R29.2 6.16,26.57 arc-45 LED2.K
PWM
  Top 0.406: U$2.35 53.55,36.87 arc45 54.26,36.58 74.01,36.58 arc-45 74.72,36.28 76.92,34.08 arc45 77.63,33.78 83.19,33.78 arc45 83.4,33.87 arc45 83.69,34.58 IC1.6
PWM_A0
  Top 0.406: U$2.38 57.11,29.25 arc45 57.82,28.96 76.8,28.96 arc45 77.51,29.25 79.46,31.2 arc-45 80.17,31.5 87.47,31.5 arc45 88.18,31.79 89.75,33.36 arc45 90.04,34.07 IC1.1
PWM_A1
  Top 0.406: U$2.37 53.55,31.79 arc45 54.26,31.5 78.07,31.5 arc45 78.78,31.79 78.95,31.96 arc-45 79.66,32.26 86.96,32.26 arc45 87.67,32.55 88.48,33.36 arc45 88.77,34.07 IC1.2
PWM_A2
  Top 0.406: U$2.36 57.11,34.33 arc45 57.82,34.04 75.28,34.04 arc-45 75.98,33.74 76.42,33.31 arc45 77.12,33.02 86.45,33.02 arc45 87.16,33.31 87.21,33.36 arc45 87.5,34.07 IC1.3
RPI_3V3  (via drill 0.7)
  Top 0.61: SJ1.1 63.75,42.93 v65.28,42.93 PCB1.17 | v64.52,23.37 64.98,22.9 arc45 65.69,22.61 PCB1.1
  Bottom 0.61: v65.28,42.93 64.81,42.46 arc45 64.52,41.75 v64.52,23.37
RPI_5V
  Top 1.016: SJ2.1 38.31,21.38 arc45 39.02,21.08 64.52,21.08 arc45 65.13,20.83 70.2,20.83 arc45 70.91,21.12 72.26,22.48 PCB1.2 PCB1.4
RPI_NRST  (via drill 0.7)
  Top 0.406: v48.77,26.92 49.24,27.39 arc-45 49.94,27.69 U$2.39
  Bottom 0.406: PCB1.P$1 50.84,26.63 arc45 50.13,26.92 v48.77,26.92
RPI_RXD  (via drill 0.7)
  Top 0.406: v74.93,32.77 PCB1.10
  Bottom 0.406: JP1.2 75.18,81.53 74.46,80.81 arc45 74.17,80.1 74.17,33.94 arc45 74.46,33.23 v74.93,32.77
RPI_TXD  (via drill 0.7)
  Top 0.406: v76.45,30.23 PCB1.8
  Bottom 0.406: JP1.1 75.44,78.99 75.22,78.78 arc45 74.93,78.07 74.93,34.96 arc45 75.22,34.25 76.16,33.31 arc-45 76.45,32.61 v76.45,30.23
S1_3V
  Top 0.61: J1.1 92.71,80.01 87.16,74.46 arc45 86.87,73.75 86.87,71.53 arc-45 86.58,70.83 86.53,70.78 arc-45 85.82,70.48 IC2.15
S1_DAT
  Top 0.406: J1.2 92.36,77.47 arc45 91.66,77.18 89.19,74.72 arc45 88.9,74.01 88.9,55.79 arc-45 88.61,55.08 87.03,53.51 arc-45 86.33,53.21 IC3.4
S2_3V  (via drill 0.7)
  Top 0.61: IC2.14 86.28,69.22 arc23 86.68,69.3 v87.38,69.6
  Bottom 0.61: v87.38,69.6 89.37,71.59 arc-45 90.08,71.88 J2.1
S2_DAT
  Top 0.406: J2.2 92.36,69.34 arc45 91.66,69.05 89.95,67.35 arc45 89.66,66.64 89.66,55.28 arc-45 89.37,54.57 87.03,52.24 arc-45 86.33,51.94 IC3.3
S3_3V  (via drill 0.7)
  Top 0.406: IC2.13 84.73,67.82 84.84,67.82
  Top 0.61: v87.38,68.07 87.25,67.94 IC2.13
  Bottom 0.61: J3.1 92.71,63.75 88.69,67.78 arc45 87.98,68.07 v87.38,68.07
S3_DAT
  Top 0.406: J3.2 92.62,61.21 arc45 91.91,60.92 90.72,59.73 arc45 90.42,59.02 90.42,54.77 arc-45 90.13,54.06 87.03,50.97 arc-45 86.33,50.67 IC3.2
S4_3V  (via drill 0.7)
  Top 0.61: v87.38,66.55 87.25,66.67 IC2.12
  Bottom 0.61: J4.1 91.48,58.13 arc-45 91.19,58.83 91.19,63.09 arc45 90.89,63.79 88.43,66.25 arc45 87.72,66.55 v87.38,66.55
S4_DAT
  Top 0.406: J4.2 90.84,53.09 arc45 90.13,52.79 87.03,49.7 arc-45 86.33,49.4 IC3.1
S5_3V  (via drill 0.7)
  Top 0.61: v87.38,65.02 86.98,65.26 arc31 86.46,65.41 IC2.11
  Bottom 0.61: J5.1 90.21,51.27 arc-45 89.92,51.98 89.92,62.07 arc45 89.62,62.78 v87.38,65.02
S5_DAT  (via drill 0.7)
  Top 0.406: v81.53,51.82 80.68,50.97 arc-45 79.98,50.67 IC3.15
  Bottom 0.406: J5.2 93.47,44.96 86.91,51.52 arc45 86.2,51.82 v81.53,51.82
SEN_A0
  Top 0.406: U$2.27 53.55,57.19 arc45 54.26,56.9 73.65,56.9 arc-54 74.47,56.48 75.14,55.54 arc54 75.95,55.12 76.4,55.12 arc59 77.25,55.6 arc-59 77.52,55.75 IC3.11 79.47,55.75 arc45 80.18,56.05 81.5,57.37 arc45 81.79,58.07 81.79,69.44 arc45 81.5,70.14 80.18,71.46 arc45 79.47,71.75 IC2.1
SEN_A1
  Top 0.406: U$2.26 57.11,59.73 arc45 57.82,59.44 74.52,59.44 arc-45 75.22,59.14 77.05,57.32 arc45 77.76,57.02 IC3.10 79.47,57.02 arc45 80.18,57.32 80.73,57.87 arc45 81.03,58.58 81.03,68.93 arc45 80.73,69.64 80.18,70.19 arc45 79.47,70.48 IC2.2
SEN_A2
  Top 0.406: U$2.25 53.55,62.27 arc45 54.26,61.98 74.01,61.98 arc-45 74.72,61.68 78.11,58.29 IC3.9 79.47,58.29 arc45 80.18,58.59 arc45 80.26,58.8 80.26,68.42 arc45 79.97,69.13 arc45 79.76,69.22 IC2.3
SEN_ENABLE
  Top 0.406: IC2.6 76.49,65.41 arc-45 75.78,65.7 74.72,66.76 arc45 74.01,67.06 65.95,67.06 | 65.95,67.06 63.7,69.3 arc45 62.99,69.6 49.94,69.6 arc45 49.24,69.3 46.01,66.08 arc-45 45.31,65.79 U$2.17 | 65.95,67.06 65.48,66.59 arc-45 64.77,66.29 R4.2
SPI1_MISO
  Top 0.406: U$2.30 58.38,48.3 arc45 59.09,48.01 PCB1.21
SPI1_MOSI
  Top 0.406: PCB1.19 66.29,45.47 65.06,46.7 arc45 64.36,46.99 58.83,46.99 arc-45 58.13,47.28 56.43,48.98 arc45 55.72,49.28 54.26,49.28 arc-45 53.55,49.57 52.87,50.25 arc-45 52.58,50.96 U$2.29
SPI1_SCK
  Top 0.406: U$2.31 52.58,48.86 arc45 52.28,49.57 50.33,51.52 arc-45 50.04,52.23 50.04,53.43 arc-45 50.33,54.14 arc-45 50.85,54.36 54.2,54.36 arc-45 54.9,54.06 56.6,52.36 arc45 57.31,52.07 58.01,52.07 arc-45 58.71,51.78 59.65,50.84 arc45 60.36,50.55 PCB1.23
STM_3V3  (via drill 0.7)
  Top 0.406: U$2.40 U$2.1
  Top 0.61: U$2.1 44.04,25.15 arc45 44.74,25.44 47.97,28.66 arc45 48.26,29.37 v48.26,41.15 48.26,65.88 arc-45 48.55,66.59 50,68.03 arc-45 50.71,68.33 U$2.23 | SJ1.3 v60.45,41.05
  Bottom 0.61: v60.45,41.05 48.26,41.05 v48.26,41.15
STM_5V
  Top 1.016: SJ2.3 34.25,29.93 arc-45 34.96,30.23 U$2.3
STM_RXD  (via drill 0.7)
  Top 0.406: v39.88,58.17 U$2.14
  Bottom 0.406: v39.88,58.17 73.11,91.4 arc-45 73.82,91.69 JP2.2
STM_TXD  (via drill 0.7)
  Top 0.406: v44.45,60.71 U$2.15
  Bottom 0.406: v44.45,60.71 44.45,61.06 arc-45 44.74,61.76 71.84,88.86 arc-45 72.55,89.15 JP2.1
WP1
  pour Bottom: 82.04,5.59 78.99,5.59 78.99,6.08 arc90 77.2,7.87 72.39,7.87 72.39,11.7 arc-90 73.39,12.7 81.04,12.7 arc-90 82.04,11.7
WP1C
  Top 0.406: IC1.15 88.77,28.23 arc-45 88.48,27.52 83.86,22.9 arc45 83.57,22.19 83.57,18.19 arc-45 83.27,17.49 78.27,12.48 arc-45 77.56,12.19 76.43,12.19 arc45 75.72,11.9 R7.1
WP2
  pour Bottom: 62.99,5.59 59.94,5.59 59.94,6.08 arc90 58.15,7.87 53.34,7.87 53.34,11.7 arc-90 54.34,12.7 61.99,12.7 arc-90 62.99,11.7
WP2C
  Top 0.406: IC1.14 87.5,28.23 arc-45 87.21,27.52 83.1,23.41 arc45 82.8,22.7 82.8,18.7 arc-45 82.51,18 78.02,13.5 arc-45 77.31,13.21 58.39,13.21 arc45 57.69,12.91 R15.1
WP3
  pour Bottom: 43.94,5.59 40.89,5.59 40.89,6.08 arc90 39.1,7.87 34.29,7.87 34.29,11.7 arc-90 35.29,12.7 42.94,12.7 arc-90 43.94,11.7
WP3C
  Top 0.406: IC1.13 86.23,28.23 arc-45 85.94,27.52 82.33,23.91 arc45 82.04,23.21 82.04,19.21 arc-45 81.75,18.5 77.76,14.52 arc-45 77.06,14.22 40.36,14.22 arc45 39.65,13.93 R23.1
WP4
  pour Bottom: 24.89,5.59 21.84,5.59 21.84,6.08 arc90 20.05,7.87 15.24,7.87 15.24,11.7 arc-90 16.24,12.7 23.89,12.7 arc-90 24.89,11.7
WP4C
  Top 0.406: IC1.12 84.96,28.23 arc-45 84.67,27.52 81.57,24.42 arc45 81.28,23.72 81.28,19.72 arc-45 80.99,19.01 77.51,15.53 arc-45 76.8,15.24 39.78,15.24 arc45 39.08,14.95 37.88,13.76 arc-45 37.18,13.46 20.55,13.46 arc45 19.84,13.17 R8.1
WP5
  pour Bottom: 94.49,21.84 94.49,16.24 arc-90 93.49,15.24 86.6,15.24 arc-90 85.6,16.24 85.6,20.84 arc-90 86.6,21.84
WP5C  (via drill 0.7)
  Top 0.406: R11.1 85.56,21.74 arc45 86.11,22.45 v86.11,23.37 | v81.28,26.16 81.63,26.16 arc45 82.33,26.45 83.4,27.52 arc45 83.69,28.23 IC1.11
  Bottom 0.406: v86.11,23.37 84.49,23.37 arc-45 83.78,23.66 v81.28,26.16

### Text on the board
tNames: WaterCtrl v0.1 | TX RX GND | github.com/janhieber/WaterCtrl | TX RX GND | PWR 5V | S1 | S2 | S3 | S4 | S5 | STM | RPI | ERR | STM | RPI | GND | 12VDC
Document: HDMI CON